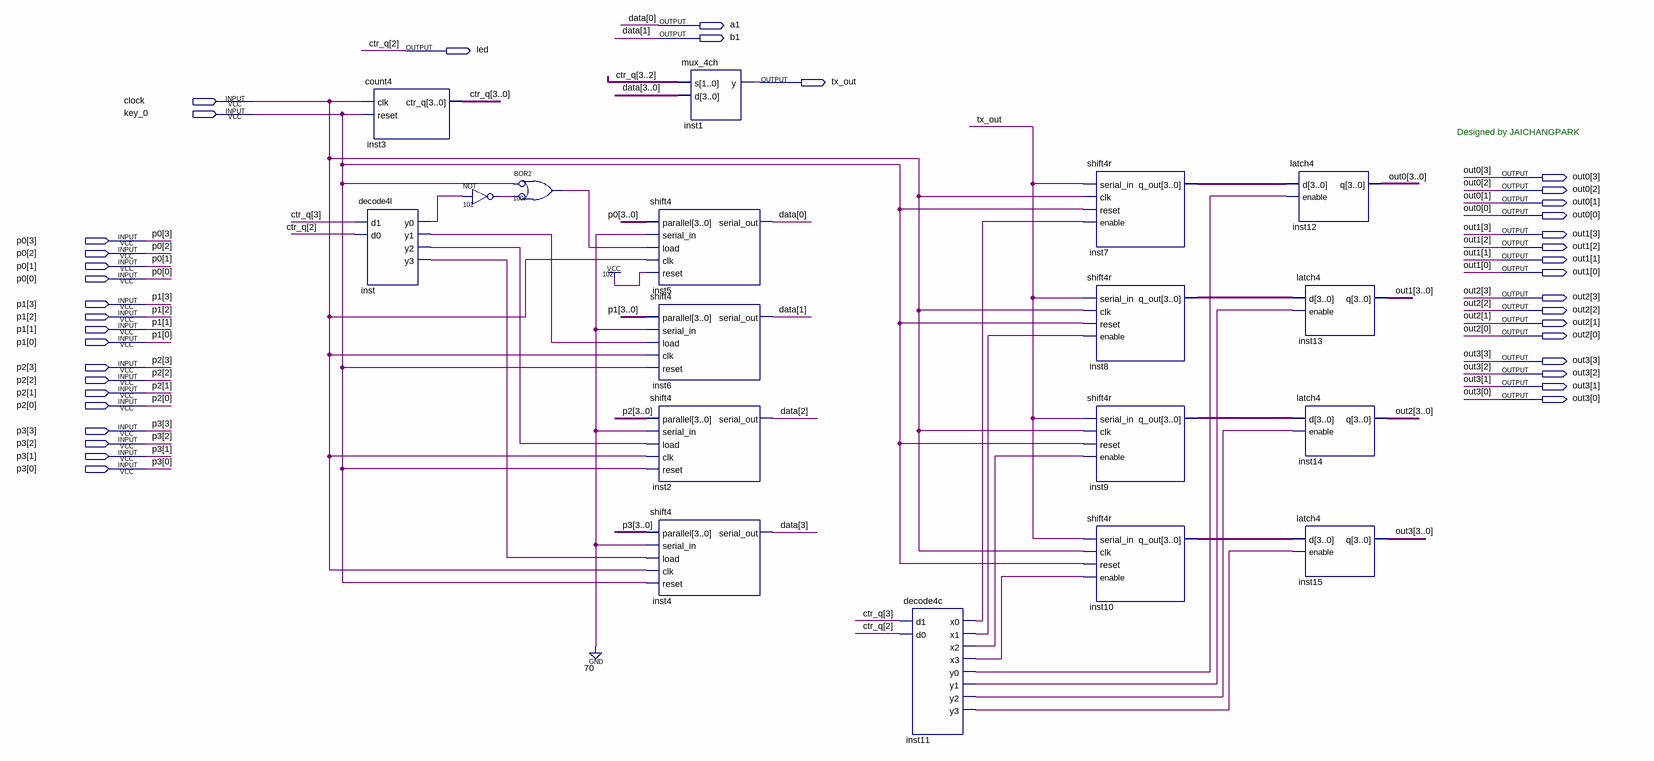
[diagram p0: schematic sheet]
// Quartus schematic tdm.bdf as structural Verilog: 18 symbols, 38 pins
module tdm (
  input  clock,
  input  key_0,
  input  [3:0] p0,
  input  [3:0] p1,
  input  [3:0] p2,
  input  [3:0] p3,
  output a1,
  output b1,
  output led,
  output tx_out,
  output [3:0] out0,
  output [3:0] out1,
  output [3:0] out2,
  output [3:0] out3
);

  wire inst11_x0, inst11_x1, inst11_x2, inst11_x3, inst11_y0, inst11_y1, inst11_y2, inst11_y3, inst_y0,
       inst_y1, inst_y2, inst_y3, n100_out, n101_out;
  wire [3:0] ctr_q, inst7_q_out, inst8_q_out, inst9_q_out, inst10_q_out;
  wire [3:2] data;

  count4 inst3 (.clk(clock), .reset(key_0), .ctr_q({ctr_q[3], led, ctr_q[1:0]}));
  decode4l inst (.d1(ctr_q[3]), .d0(led), .y0(inst_y0), .y1(inst_y1), .y2(inst_y2), .y3(inst_y3));
  not u_101 (n101_out, inst_y0);
  or u_100 (n100_out, ~key_0, ~n101_out);  // BOR2
  shift4 inst5 (.parallel(p0), .serial_in(1'b0), .load(n100_out), .clk(clock), .reset(1'b1), .serial_out(a1));
  shift4 inst6 (.parallel(p1), .serial_in(1'b0), .load(inst_y1), .clk(clock), .reset(key_0), .serial_out(b1));
  shift4 inst2 (.parallel(p2), .serial_in(1'b0), .load(inst_y2), .clk(clock), .reset(key_0), .serial_out(data[2]));
  shift4 inst4 (.parallel(p3), .serial_in(1'b0), .load(inst_y3), .clk(clock), .reset(key_0), .serial_out(data[3]));
  mux_4ch inst1 (.s({ctr_q[3], led}), .d({data, b1, a1}), .y(tx_out));
  decode4c inst11 (
    .d1(ctr_q[3]), .d0(led), .x0(inst11_x0), .x1(inst11_x1), .x2(inst11_x2), .x3(inst11_x3), .y0(inst11_y0),
    .y1(inst11_y1), .y2(inst11_y2), .y3(inst11_y3));
  shift4r inst7 (.serial_in(tx_out), .clk(clock), .reset(key_0), .enable(inst11_x0), .q_out(inst7_q_out));
  shift4r inst8 (.serial_in(tx_out), .clk(clock), .reset(key_0), .enable(inst11_x1), .q_out(inst8_q_out));
  shift4r inst9 (.serial_in(tx_out), .clk(clock), .reset(key_0), .enable(inst11_x2), .q_out(inst9_q_out));
  shift4r inst10 (.serial_in(tx_out), .clk(clock), .reset(key_0), .enable(inst11_x3), .q_out(inst10_q_out));
  latch4 inst12 (.d(inst7_q_out), .enable(inst11_y0), .q(out0));
  latch4 inst13 (.d(inst8_q_out), .enable(inst11_y1), .q(out1));
  latch4 inst14 (.d(inst9_q_out), .enable(inst11_y2), .q(out2));
  latch4 inst15 (.d(inst10_q_out), .enable(inst11_y3), .q(out3));

  // Other names for the same wires on the sheet: ctr_q[2] = led; data[1:0] = {b1, a1}

  // Notes on the sheet:
  //   Designed by JAICHANGPARK
endmodule
